# Altium schematic sheet Sheet1.SchDoc
size A4; SheetNumber: 1; SheetTotal: 1
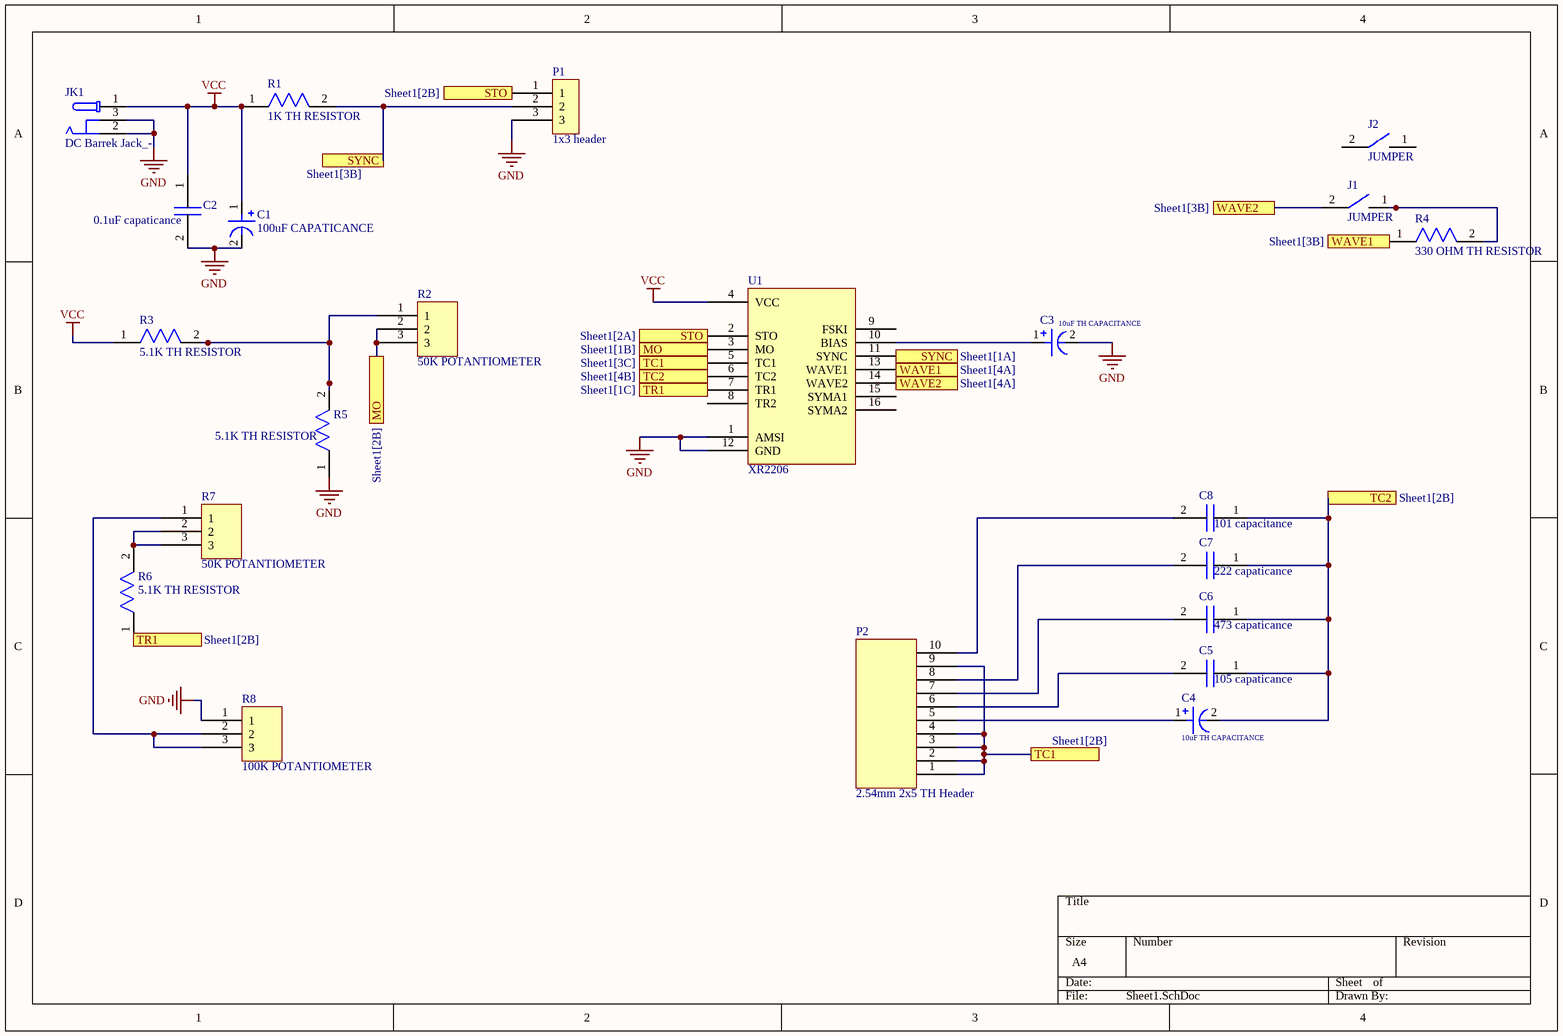
[diagram p0: Sheet1.SchDoc]

## Parts
C1  100uF CAPATICANCE  [EEUFR1V101B]
C2  0.1uF capaticance  [TH CAPACITOR]
C3  10uF TH CAPACITANCE  [10uf capacitance]
C4  10uF TH CAPACITANCE  [10uf capacitance]
C5  105 capaticance  [TH CAPACITOR]
C6  473 capaticance  [TH CAPACITOR]
C7  222 capaticance  [TH CAPACITOR]
C8  101 capacitance  [TH CAPACITOR]
J1  JUMPER  [JUMPER]
J2  JUMPER  [JUMPER]
JK1  DC Barrek Jack_-  [DC BARREL JACK]
P1  1x3 header  [1x3 header - duplicate]
P2  2.54mm 2x5 TH Header  [2x5 HEADER]
R1  1K TH RESISTOR  [TH RESISTOR]
R2  50K POTANTIOMETER  [POTANTIOMETER]
R3  5.1K TH RESISTOR  [TH RESISTOR]
R4  330 OHM TH RESISTOR  [TH RESISTOR]
R5  5.1K TH RESISTOR  [TH RESISTOR]
R6  5.1K TH RESISTOR  [TH RESISTOR]
R7  50K POTANTIOMETER  [POTANTIOMETER]
R8  100K POTANTIOMETER  [POTANTIOMETER]
U1  XR2206  [XR2206]

## Ports
MO (see Sheet1[1B]), MO (see Sheet1[2B]), STO (see Sheet1[2A]), STO (see Sheet1[2B]), SYNC (see Sheet1[1A]), SYNC (see Sheet1[3B]), TC1 (see Sheet1[2B]), TC1 (see Sheet1[3C]), TC2 (see Sheet1[2B]), TC2 (see Sheet1[4B]), TR1 (see Sheet1[1C]), TR1 (see Sheet1[2B]), WAVE1 (see Sheet1[3B]), WAVE1 (see Sheet1[4A]), WAVE2 (see Sheet1[3B]), WAVE2 (see Sheet1[4A])

## Nets
GND: C1.2 C2.2 C3.2 JK1.2 JK1.3 P1.3 R5.1 R8.1 U1.1(AMSI) U1.12(GND)
VCC: C1.1 C2.1 JK1.1 R1.1 R3.1 U1.4(VCC)
MO: R2.2 R2.3 U1.3(MO) ; port MO
STO: P1.1 U1.2(STO) ; port STO
SYNC: P1.2 R1.2 U1.11(SYNC) ; port SYNC
TC1: P2.1 P2.2 P2.3 P2.4 P2.9 U1.5(TC1) ; port TC1
TC2: C4.2 C5.1 C6.1 C7.1 C8.1 U1.6(TC2) ; port TC2
TR1: R6.1 U1.7(TR1) ; port TR1
WAVE1: R4.1 U1.13(WAVE1) ; port WAVE1
WAVE2: J1.2 U1.14(WAVE2) ; port WAVE2
NetC3_1: C3.1 U1.10(BIAS)
NetC4_1: C4.1 P2.5
NetC5_2: C5.2 P2.6
NetC6_2: C6.2 P2.7
NetC7_2: C7.2 P2.8
NetC8_2: C8.2 P2.10
NetJ1_1: J1.1 R4.2
NetR2_1: R2.1 R3.2 R5.2
NetR6_2: R6.2 R7.2 R7.3
NetR7_1: R7.1 R8.2 R8.3

Not connected (* = marked no-connect by the designer): J2 1 2; U1 8(TR2) 9(FSKI) 15(SYMA1) 16(SYMA2)

## Library data of the parts
JK1 = DC Barrek Jack_-: Power Barrel Connector Jack 2.10mm ID _0.083_, 5.50mm OD _0.217_ Through Hole, Right Angle; MF: MPD; MP: EJ508A; Package: Non-Standard MPD; Value: *; SnapEDA_Link: https://www.snapeda.com/parts/EJ508A/MPD%20%28Memory%20Protection%20Devices%29/view-part/474399/?ref=snap; Price: None; Availability: Unavailable
P2 = 2.54mm 2x5 TH Header: 2.54mm 2X3 TH Header
R8 = 100K POTANTIMETER